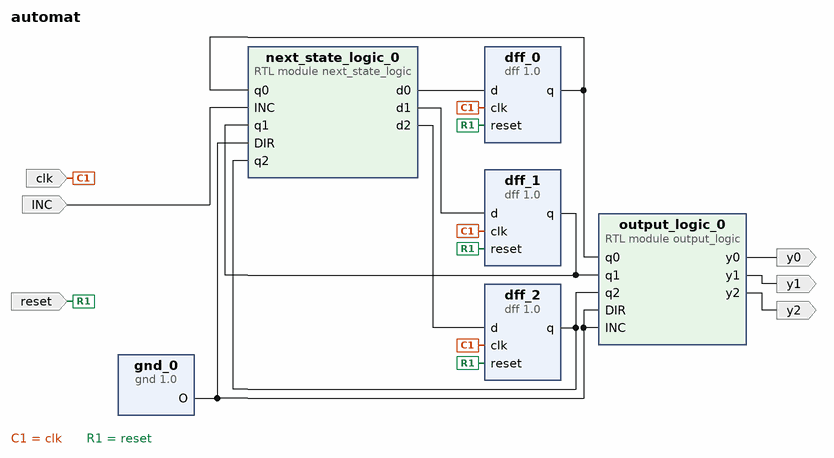
[diagram p0: block diagram of the top level]
# Vivado block design automat, xc7a35tcpg236-1, Vivado 2018.3
create_bd_design automat

create_bd_port -dir I clk
create_bd_port -dir I reset
create_bd_port -dir I INC
create_bd_port -dir O y0
create_bd_port -dir O y1
create_bd_port -dir O y2

create_bd_cell -type module -reference next_state_logic next_state_logic_0
create_bd_cell -type module -reference output_logic output_logic_0
create_bd_cell -type ip -vlnv FIT:user:dff:1.0 dff_0
create_bd_cell -type ip -vlnv FIT:user:dff:1.0 dff_1
create_bd_cell -type ip -vlnv FIT:user:dff:1.0 dff_2
create_bd_cell -type ip -vlnv FIT:user:gnd:1.0 gnd_0

# ---- connections ----

connect_bd_net [get_bd_pins next_state_logic_0/d0] [get_bd_pins dff_0/d]
connect_bd_net [get_bd_pins next_state_logic_0/d1] [get_bd_pins dff_1/d]
connect_bd_net [get_bd_pins next_state_logic_0/d2] [get_bd_pins dff_2/d]
connect_bd_net [get_bd_ports clk] [get_bd_pins dff_2/clk] [get_bd_pins dff_1/clk] [get_bd_pins dff_0/clk]
connect_bd_net [get_bd_ports reset] [get_bd_pins dff_2/reset] [get_bd_pins dff_1/reset] [get_bd_pins dff_0/reset]
connect_bd_net [get_bd_pins dff_0/q] [get_bd_pins output_logic_0/q0] [get_bd_pins next_state_logic_0/q0]
connect_bd_net [get_bd_pins dff_1/q] [get_bd_pins output_logic_0/q1] [get_bd_pins next_state_logic_0/q1]
connect_bd_net [get_bd_pins dff_2/q] [get_bd_pins output_logic_0/q2] [get_bd_pins next_state_logic_0/q2]
connect_bd_net [get_bd_ports INC] [get_bd_pins next_state_logic_0/INC]
connect_bd_net [get_bd_pins gnd_0/O] [get_bd_pins output_logic_0/INC] [get_bd_pins output_logic_0/DIR] [get_bd_pins next_state_logic_0/DIR]
connect_bd_net [get_bd_pins output_logic_0/y0] [get_bd_ports y0]
connect_bd_net [get_bd_pins output_logic_0/y1] [get_bd_ports y1]
connect_bd_net [get_bd_pins output_logic_0/y2] [get_bd_ports y2]

validate_bd_design
save_bd_design
